# EAGLE design Stepper5 (EAGLE 7.6.0)
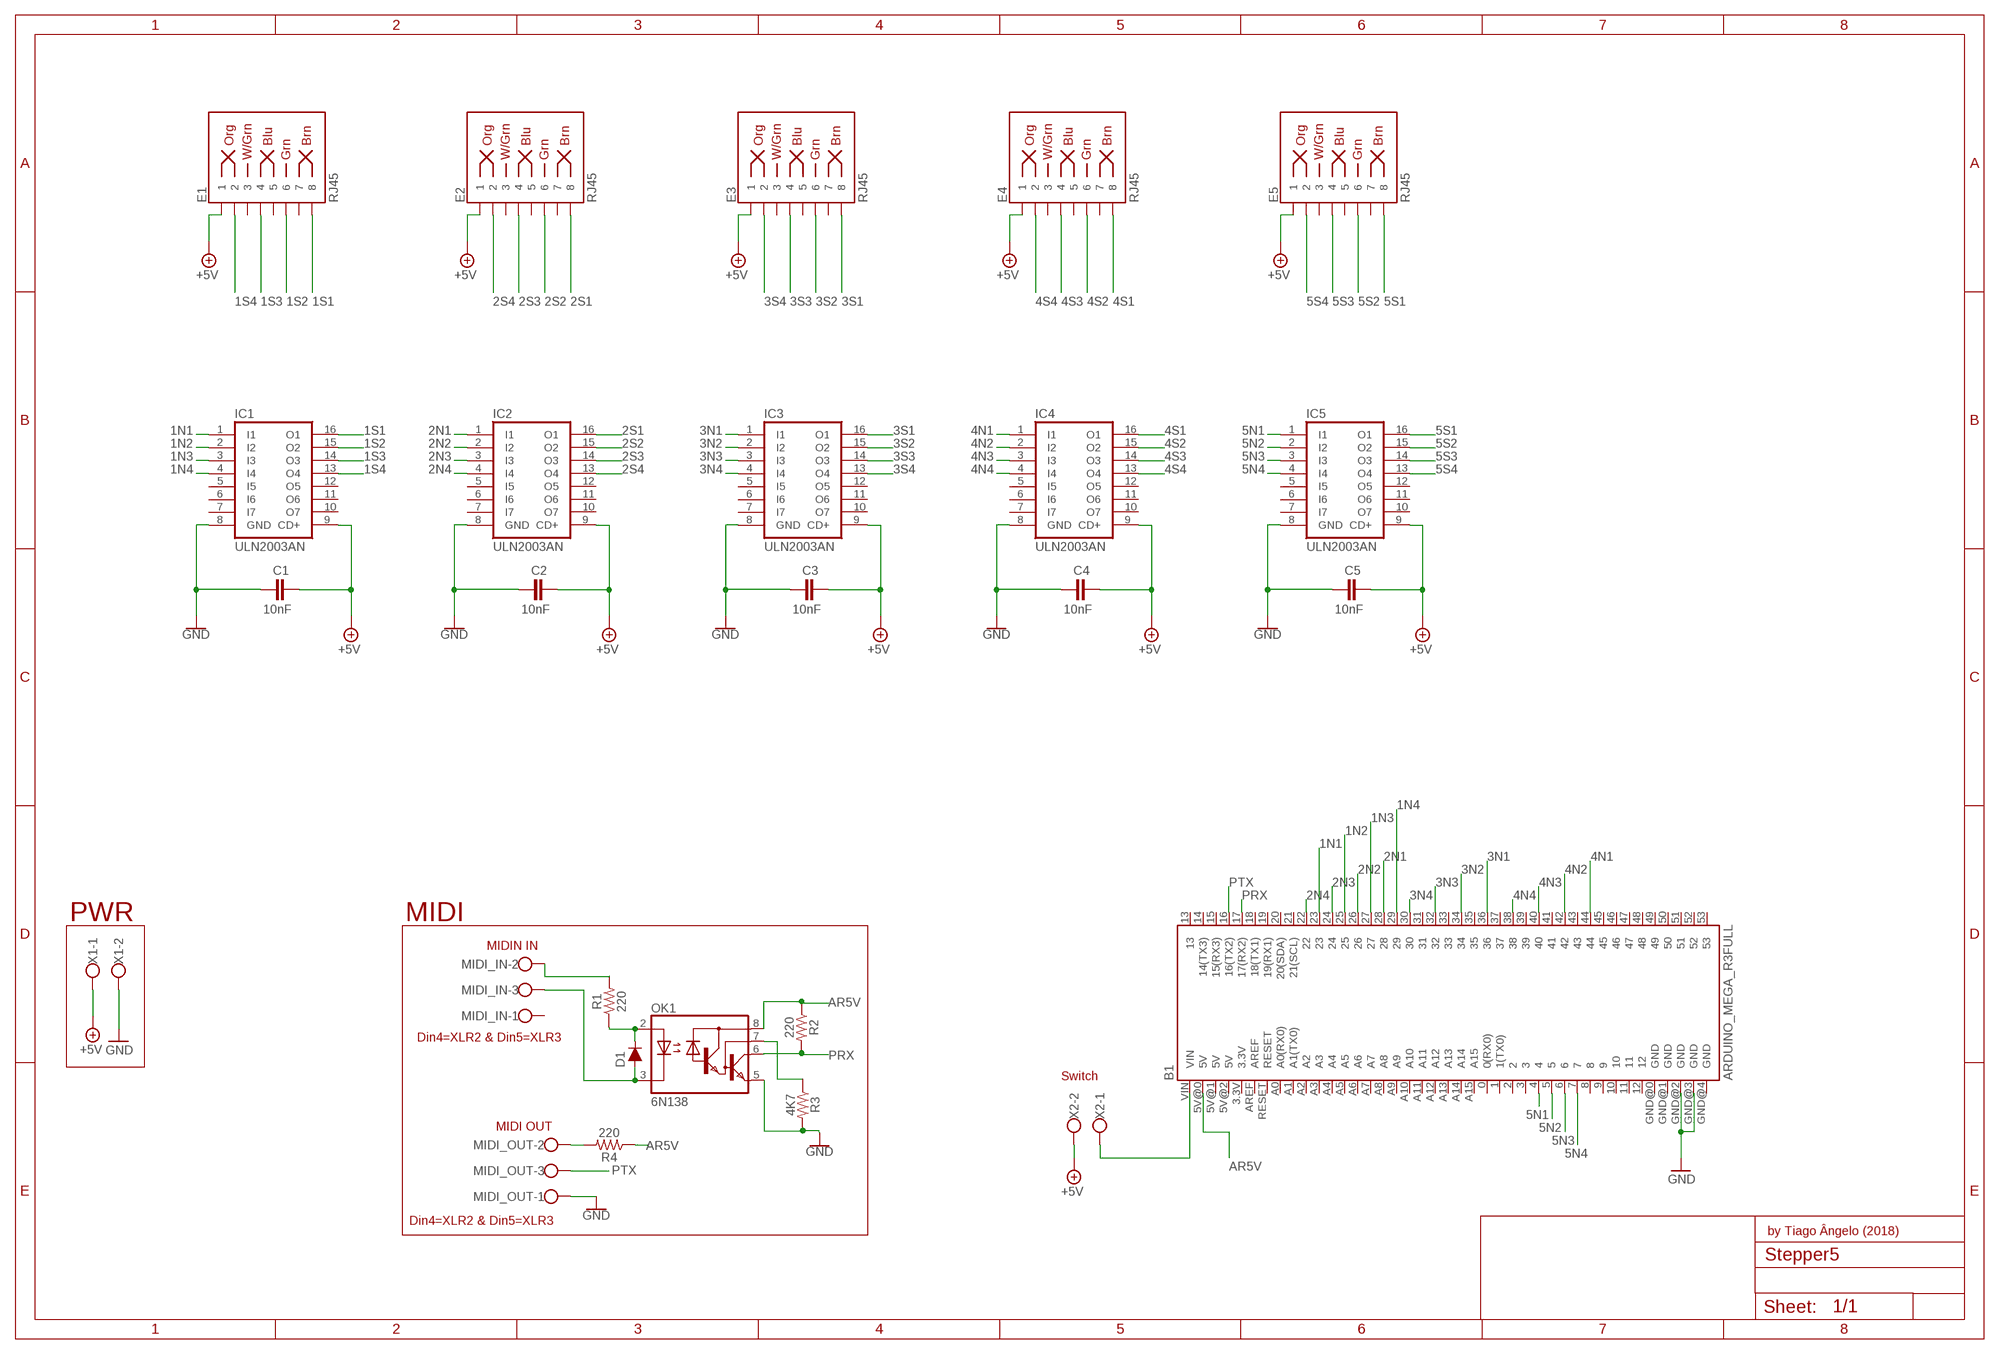
[diagram p0: schematic, sheet 1]

## Parts
B1  ARDUINO_MEGA_R3FULL  [ARDUINO_MEGA]
C1  10nF  C5/2.5  [C5B2.5]
C2  10nF  C5/2.5  [C5B2.5]
C3  10nF  C5/2.5  [C5B2.5]
C4  10nF  C5/2.5  [C5B2.5]
C5  10nF  C5/2.5  [C5B2.5]
D1  200mA/100V/1V  DIODE-1N4148  [DIODE-1N4148]
E1  RJ45  RJ45-8  [RJ45-8]
E2  RJ45  RJ45-8  [RJ45-8]
E3  RJ45  RJ45-8  [RJ45-8]
E4  RJ45  RJ45-8  [RJ45-8]
E5  RJ45  RJ45-8  [RJ45-8]
IC1  ULN2003AN  [DIL16]
IC2  ULN2003AN  [DIL16]
IC3  ULN2003AN  [DIL16]
IC4  ULN2003AN  [DIL16]
IC5  ULN2003AN  [DIL16]
MIDI_IN  W237-103  [W237-103]
MIDI_OUT  W237-103  [W237-103]
OK1  6N138  [DIL08]
R1  220  1KOHM-HORIZ-1/4W-5%  [AXIAL-0.3]
R2  220  1KOHM-HORIZ-1/4W-5%  [AXIAL-0.3]
R3  4K7  1KOHM-HORIZ-1/4W-5%  [AXIAL-0.3]
R4  220  1KOHM-HORIZ-1/4W-5%  [AXIAL-0.3]
X1  W237-102  [W237-102]
X2  W237-102  [W237-102]

## Nets
1N1: B1.23 IC1.1(I1)
1N2: B1.25 IC1.2(I2)
1N3: B1.27 IC1.3(I3)
1N4: B1.29 IC1.4(I4)
1S1: E1.8 IC1.16(O1)
1S2: E1.6 IC1.15(O2)
1S3: E1.4 IC1.14(O3)
1S4: E1.2 IC1.13(O4)
2N1: B1.28 IC2.1(I1)
2N2: B1.26 IC2.2(I2)
2N3: B1.24 IC2.3(I3)
2N4: B1.22 IC2.4(I4)
2S1: E2.8 IC2.16(O1)
2S2: E2.6 IC2.15(O2)
2S3: E2.4 IC2.14(O3)
2S4: E2.2 IC2.13(O4)
3N1: B1.36 IC3.1(I1)
3N2: B1.34 IC3.2(I2)
3N3: B1.32 IC3.3(I3)
3N4: B1.30 IC3.4(I4)
3S1: E3.8 IC3.16(O1)
3S2: E3.6 IC3.15(O2)
3S3: E3.4 IC3.14(O3)
3S4: E3.2 IC3.13(O4)
4N1: B1.44 IC4.1(I1)
4N2: B1.42 IC4.2(I2)
4N3: B1.40 IC4.3(I3)
4N4: B1.38 IC4.4(I4)
4S1: E4.8 IC4.16(O1)
4S2: E4.6 IC4.15(O2)
4S3: E4.4 IC4.14(O3)
4S4: E4.2 IC4.13(O4)
5N1: B1.4 IC5.1(I1)
5N2: B1.5 IC5.2(I2)
5N3: B1.6 IC5.3(I3)
5N4: B1.7 IC5.4(I4)
5S1: E5.8 IC5.16(O1)
5S2: E5.6 IC5.15(O2)
5S3: E5.4 IC5.14(O3)
5S4: E5.2 IC5.13(O4)
+5V: C1.2 C2.2 C3.2 C4.2 C5.2 E1.1 E2.1 E3.1 E4.1 E5.1 IC1.9(CD+) IC2.9(CD+) IC3.9(CD+) IC4.9(CD+) IC5.9(CD+) X1.1 X2.2
AR5V: B1.5V@0(5V) OK1.8(VCC) R2.P$1 R4.P$1
GND [GND]: B1.GND@2(GND) B1.GND@3(GND) C1.1 C2.1 C3.1 C4.1 C5.1 IC1.8(GND) IC2.8(GND) IC3.8(GND) IC4.8(GND) IC5.8(GND) MIDI_OUT.1 OK1.5(GND) R3.P$2 X1.2
N$1: B1.VIN X2.1
N$2: MIDI_OUT.2 R4.P$2
N$25: D1.A MIDI_IN.3 OK1.3(C)
N$26: D1.C OK1.2(A) R1.P$1
N$27: MIDI_IN.2 R1.P$2
N$29: OK1.7(VB) R3.P$1
PRX: B1.17(17(RX2)) OK1.6(VO) R2.P$2
PTX: B1.16(16(TX2)) MIDI_OUT.3
Unconnected: B1.0(0(RX0)) B1.1(1(TX0)) B1.2 B1.3 B1.3.3V B1.5V@1(5V) B1.5V@2(5V) B1.8 B1.9 B1.10 B1.11 B1.12 B1.13 B1.14(14(TX3)) B1.15(15(RX3)) B1.18(18(TX1)) B1.19(19(RX1)) B1.20(20(SDA)) B1.21(21(SCL)) B1.31 B1.33 B1.35 B1.37 B1.39 B1.41 B1.43 B1.45 B1.46 B1.47 B1.48 B1.49 B1.50 B1.51 B1.52 B1.53 B1.A0(A0(RX0)) B1.A1(A1(TX0)) B1.A2 B1.A3 B1.A4 B1.A5 B1.A6 B1.A7 B1.A8 B1.A9 B1.A10 B1.A11 B1.A12 B1.A13 B1.A14 B1.A15 B1.AREF B1.GND@0(GND) B1.GND@1(GND) B1.GND@4(GND) B1.RESET E1.3 E1.5 E1.7 E2.3 E2.5 E2.7 E3.3 E3.5 E3.7 E4.3 E4.5 E4.7 E5.3 E5.5 E5.7 IC1.5(I5) IC1.6(I6) IC1.7(I7) IC1.10(O7) IC1.11(O6) IC1.12(O5) IC2.5(I5) IC2.6(I6) IC2.7(I7) IC2.10(O7) IC2.11(O6) IC2.12(O5) IC3.5(I5) IC3.6(I6) IC3.7(I7) IC3.10(O7) IC3.11(O6) IC3.12(O5) IC4.5(I5) IC4.6(I6) IC4.7(I7) IC4.10(O7) IC4.11(O6) IC4.12(O5) IC5.5(I5) IC5.6(I6) IC5.7(I7) IC5.10(O7) IC5.11(O6) IC5.12(O5) MIDI_IN.1

## Notes on the sheet
- PWR | MIDI
- MIDIN IN
- Din4=XLR2 & Din5=XLR3
- Switch
- MIDI OUT
- Din4=XLR2 & Din5=XLR3
- by Tiago Ângelo (2018)

## Library data of the parts
B1 = SparkFun-Boards:ARDUINO_MEGA_R3: Arduino Mega R3 ATmega2560 R3 compatible footprint. SparkFun Products: Arduino Mega 2560 R3 <https://www.sparkfun.com/products/11061>
C1-C5 = capacitor-wima:C: CAPACITOR naming: grid - package width
D1 = SparkFun-DiscreteSemi:DIODE: Diode These are standard reverse protection diodes and small signal diodes. SparkFun Products: SparkFun SparkPunk Sound Kit <https://www.sparkfun.com/products/11177> SparkFun ESP8266 Thing <https://www.sparkfun.com/products/13231>; PROD_ID: DIO-08378
E1-E5 = SparkFun-Connectors:RJ45-8: RJ45 Jack - 8 pin Simple RJ45, 8-pin connection. Commonly used for Cat5, Cat5e, and Cat6 Ethernet cables. Here is the connector we sell at SparkFun: RJ45 8-Pin Connector <https://www.sparkfun.com/products/643> (PRT-00643) Datasheet <https://cdn.sparkfun.com/datasheets/Prototyping/04908.pdf> It is used on this SparkFun product: SparkFun RJ45 Breakout <https://www.sparkfun.com/products/716> (BOB-00716) Note, you may also be interested in the "MAGJACK" version of this. It is basically a RJ45 connector, but also has some status LEDs built into the connector housing. You can check that out in this library at the device named "MAGJACK.dev" and see these products online: RJ45 Ethernet MagJack-Compatible <https://www.sparkfun.com/products/8534> (PRT-08534) SparkFun RJ45 MagJack Breakout <https://www.sparkfun.com/products/13021> (BOB-13021); PROD_ID: CONN-08506; SF_ID: PRT-00643
IC1-IC5 = uln-udn:ULN2003A: DRIVER ARRAY
MIDI_IN MIDI_OUT = con-wago-500:W237-103: WAGO SCREW CLAMP; MPN: 237-103; OC_FARNELL: unknown; OC_NEWARK: 18M7116
OK1 = optocoupler:6N138: MOTOROLA OPTO COUPLER; MF: VISHAY/TELEFUNKEN; MPN: 6N138; OC_FARNELL: 9860150; OC_NEWARK: 35K5294
R1-R4 = SparkFun-Resistors:1KOHM: 1kΩ resistor A resistor is a passive two-terminal electrical component that implements electrical resistance as a circuit element. Resistors act to reduce current flow, and, at the same time, act to lower voltage levels within circuits. - Wikipedia; PROD_ID: RES-08380; VALUE: 1k
X1 X2 = con-wago-500:W237-102: WAGO SCREW CLAMP; MPN: 237-102; OC_FARNELL: unknown; OC_NEWARK: 70K9898

## Net classes
1 GND: width 1.016 mm, drill 0.508 mm, clearance 0.508 mm

## Board
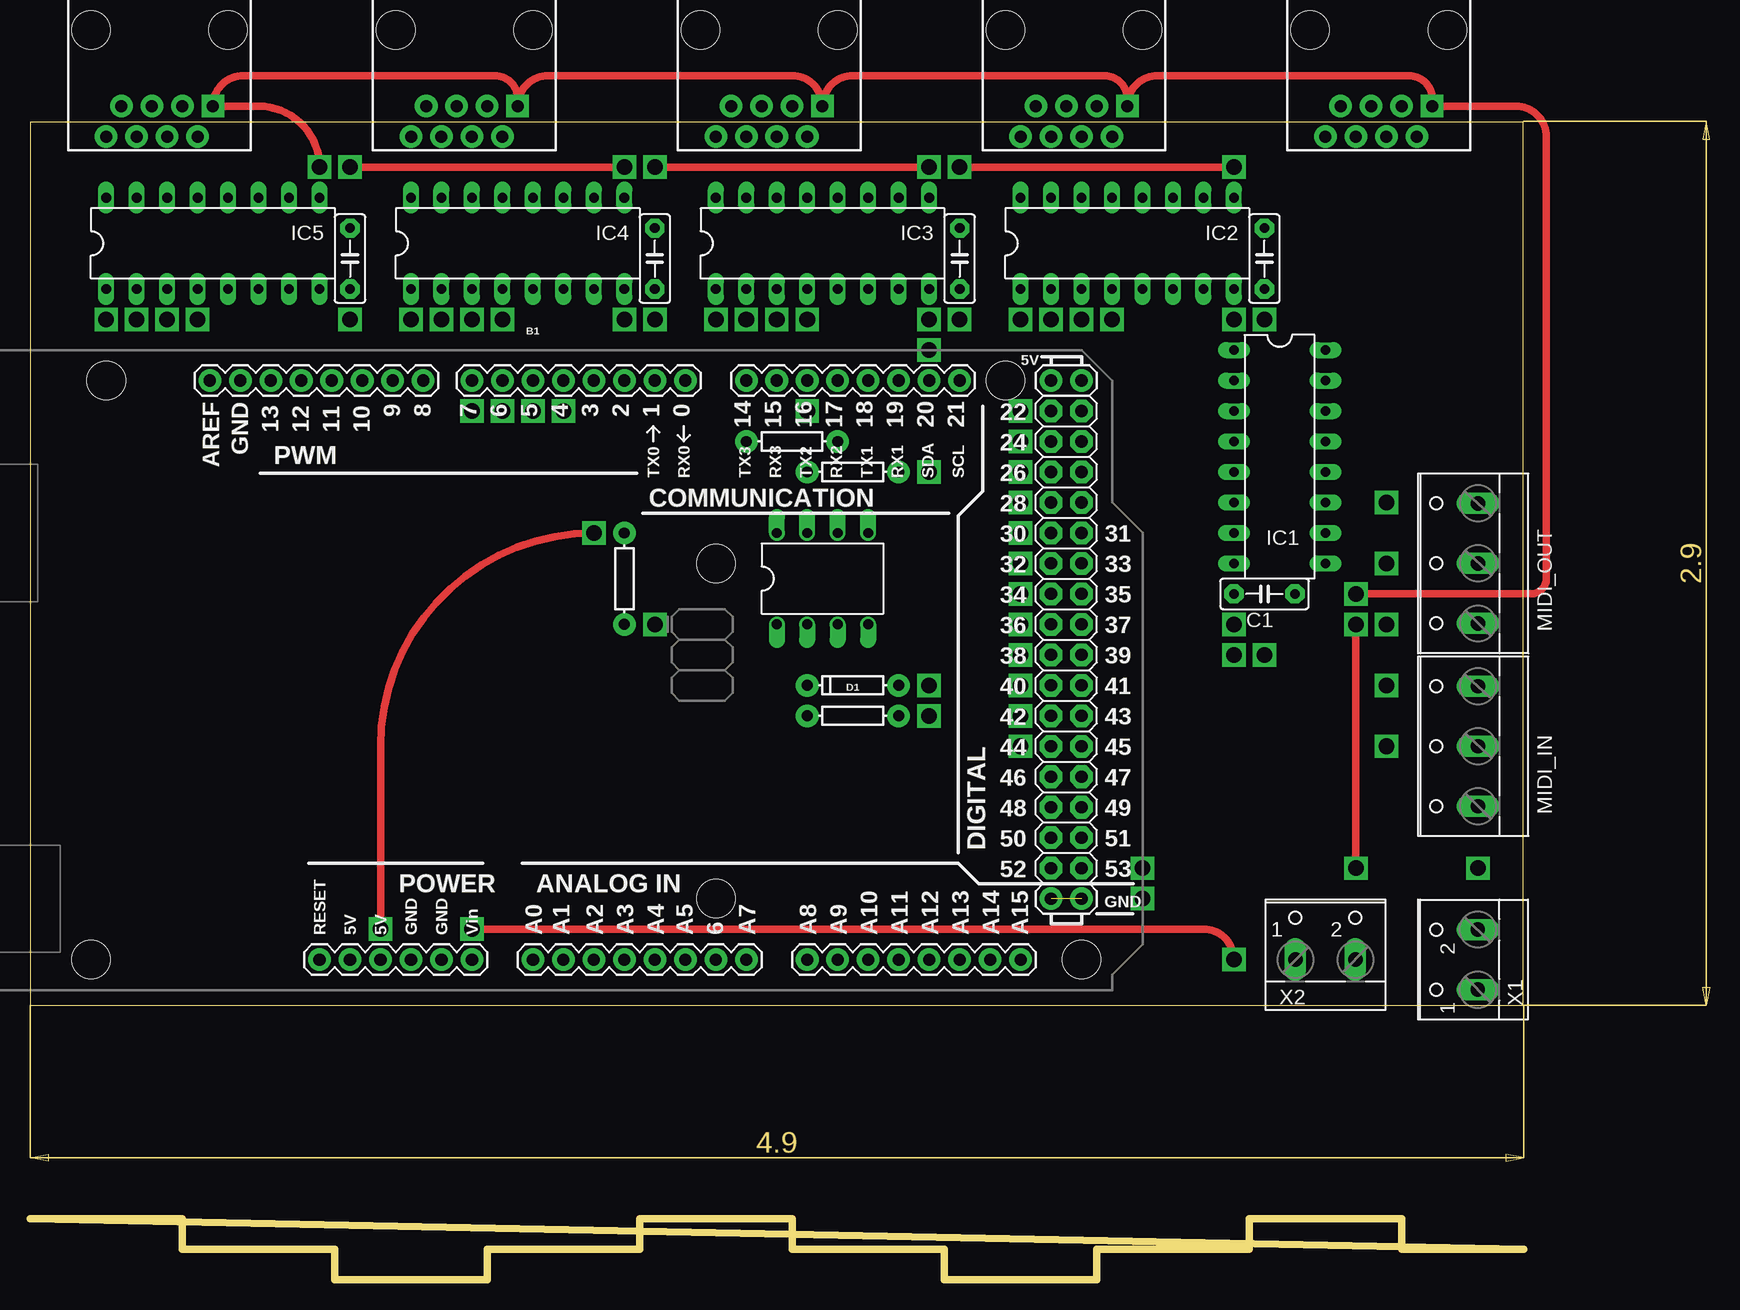
[diagram p1: board, top side]
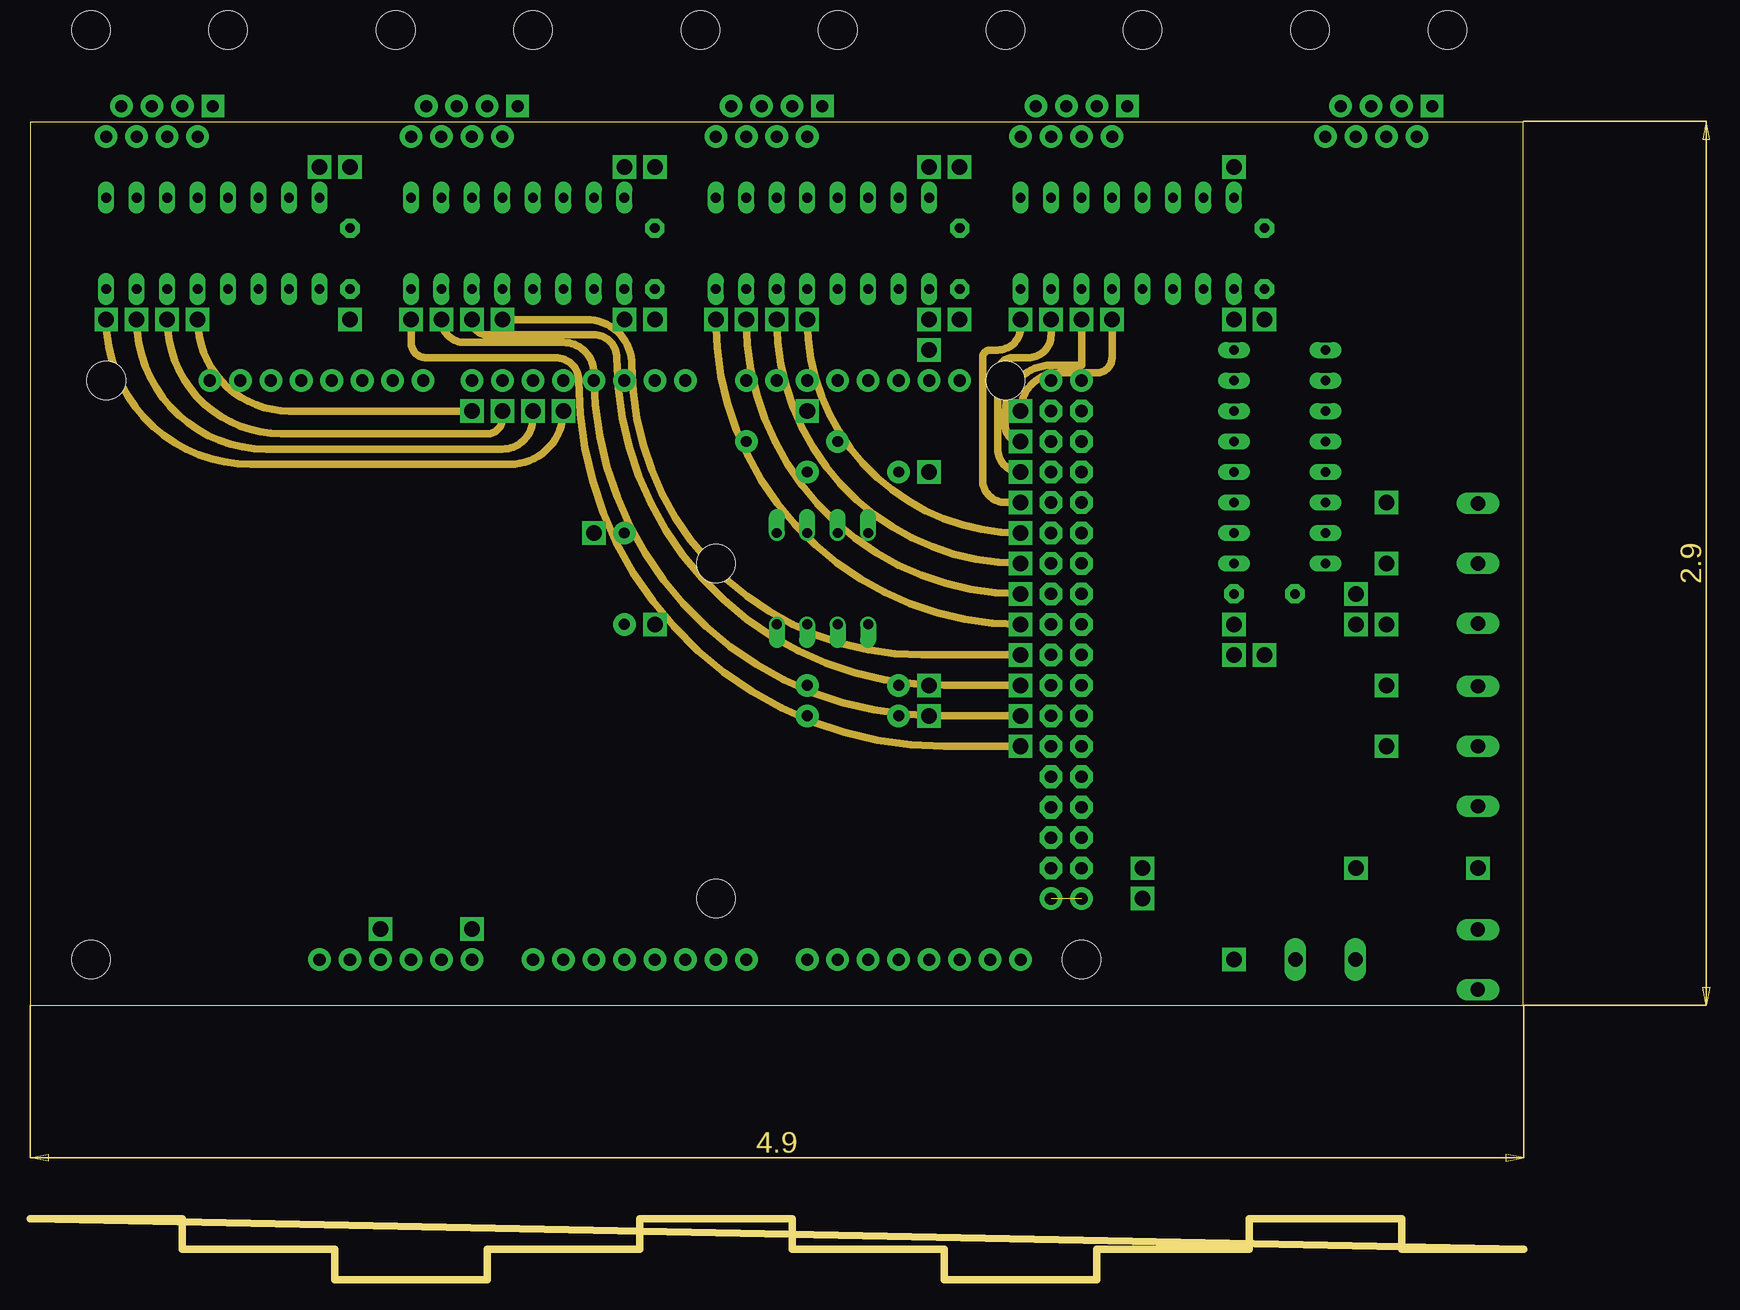
[diagram p2: board, inner layer FlyWire1]
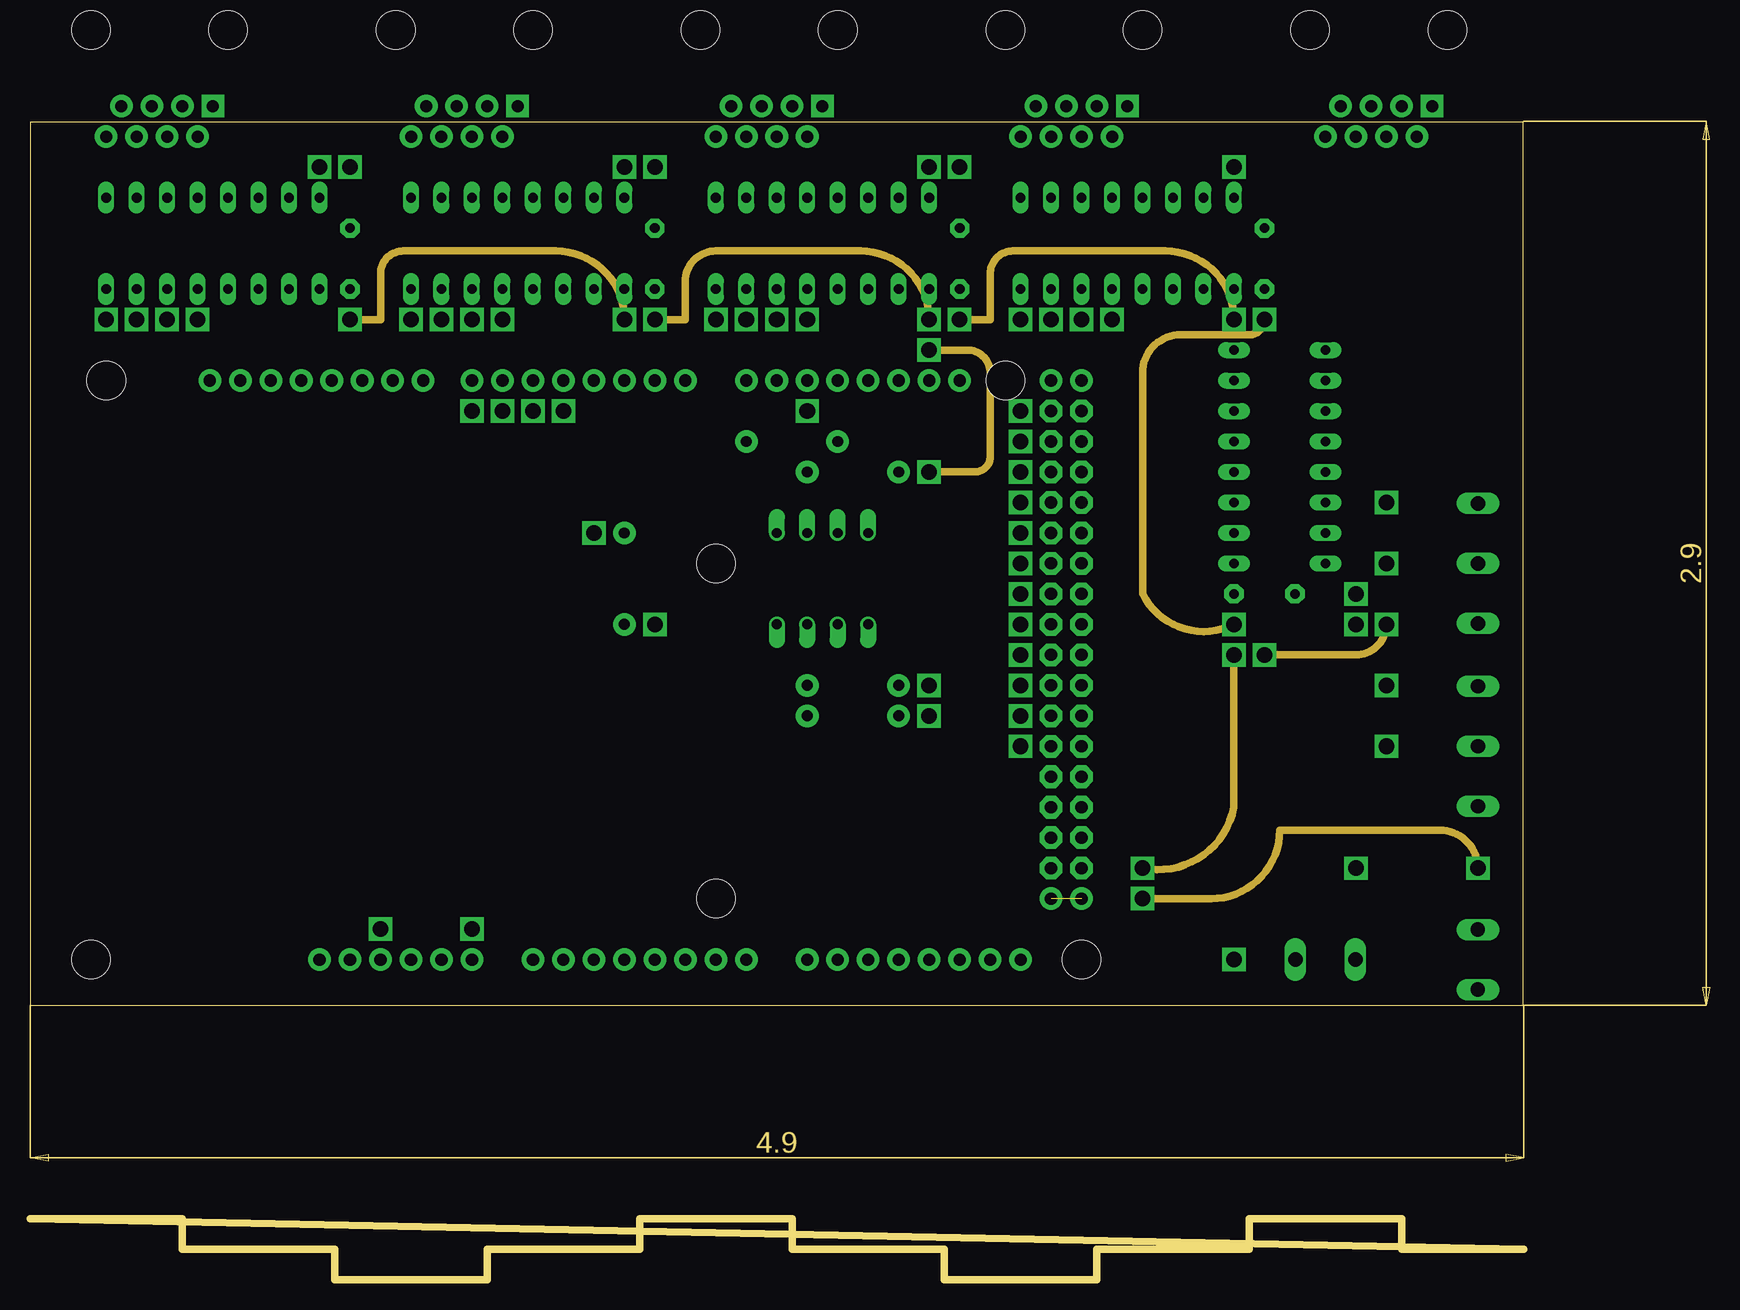
[diagram p3: board, inner layer WireGND]
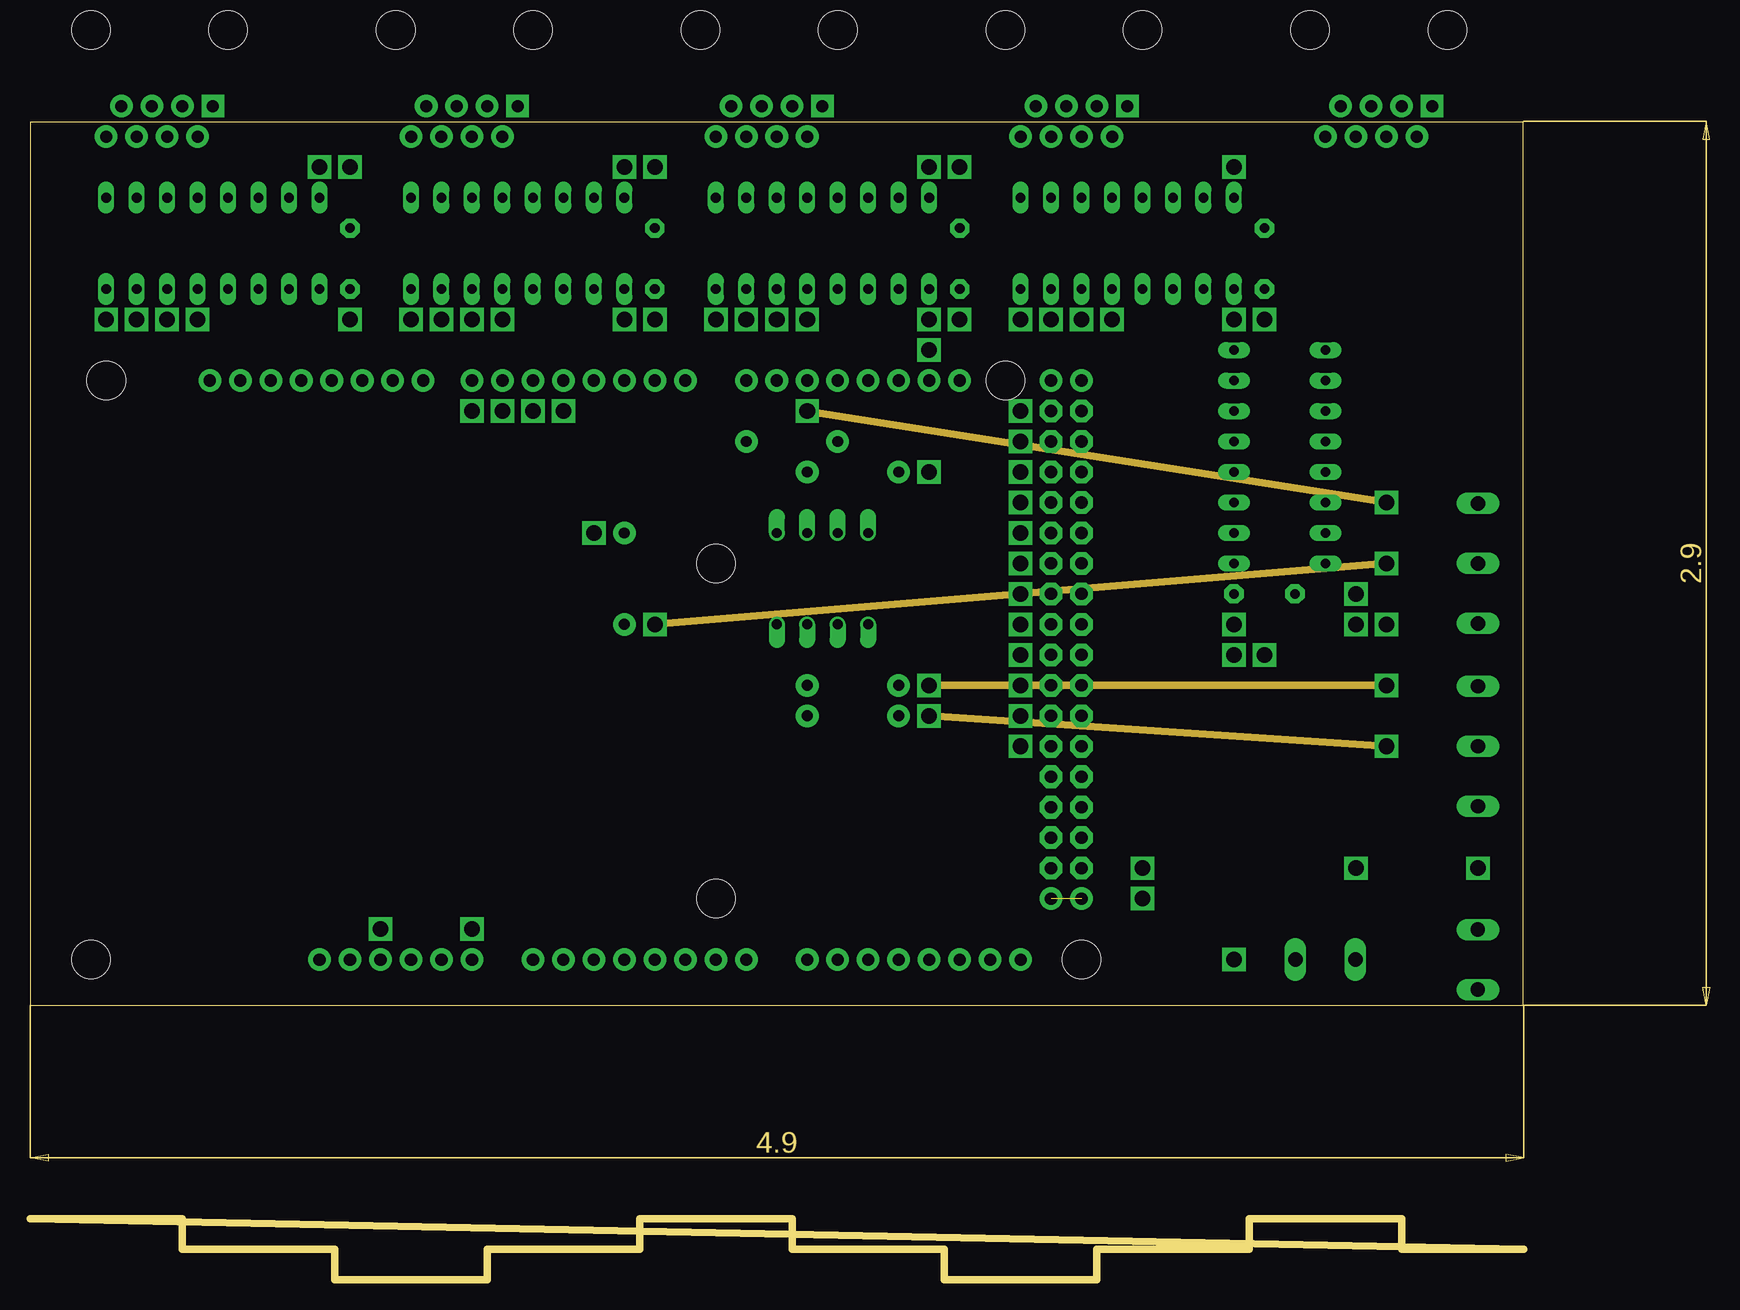
[diagram p4: board, inner layer FlyWire2]
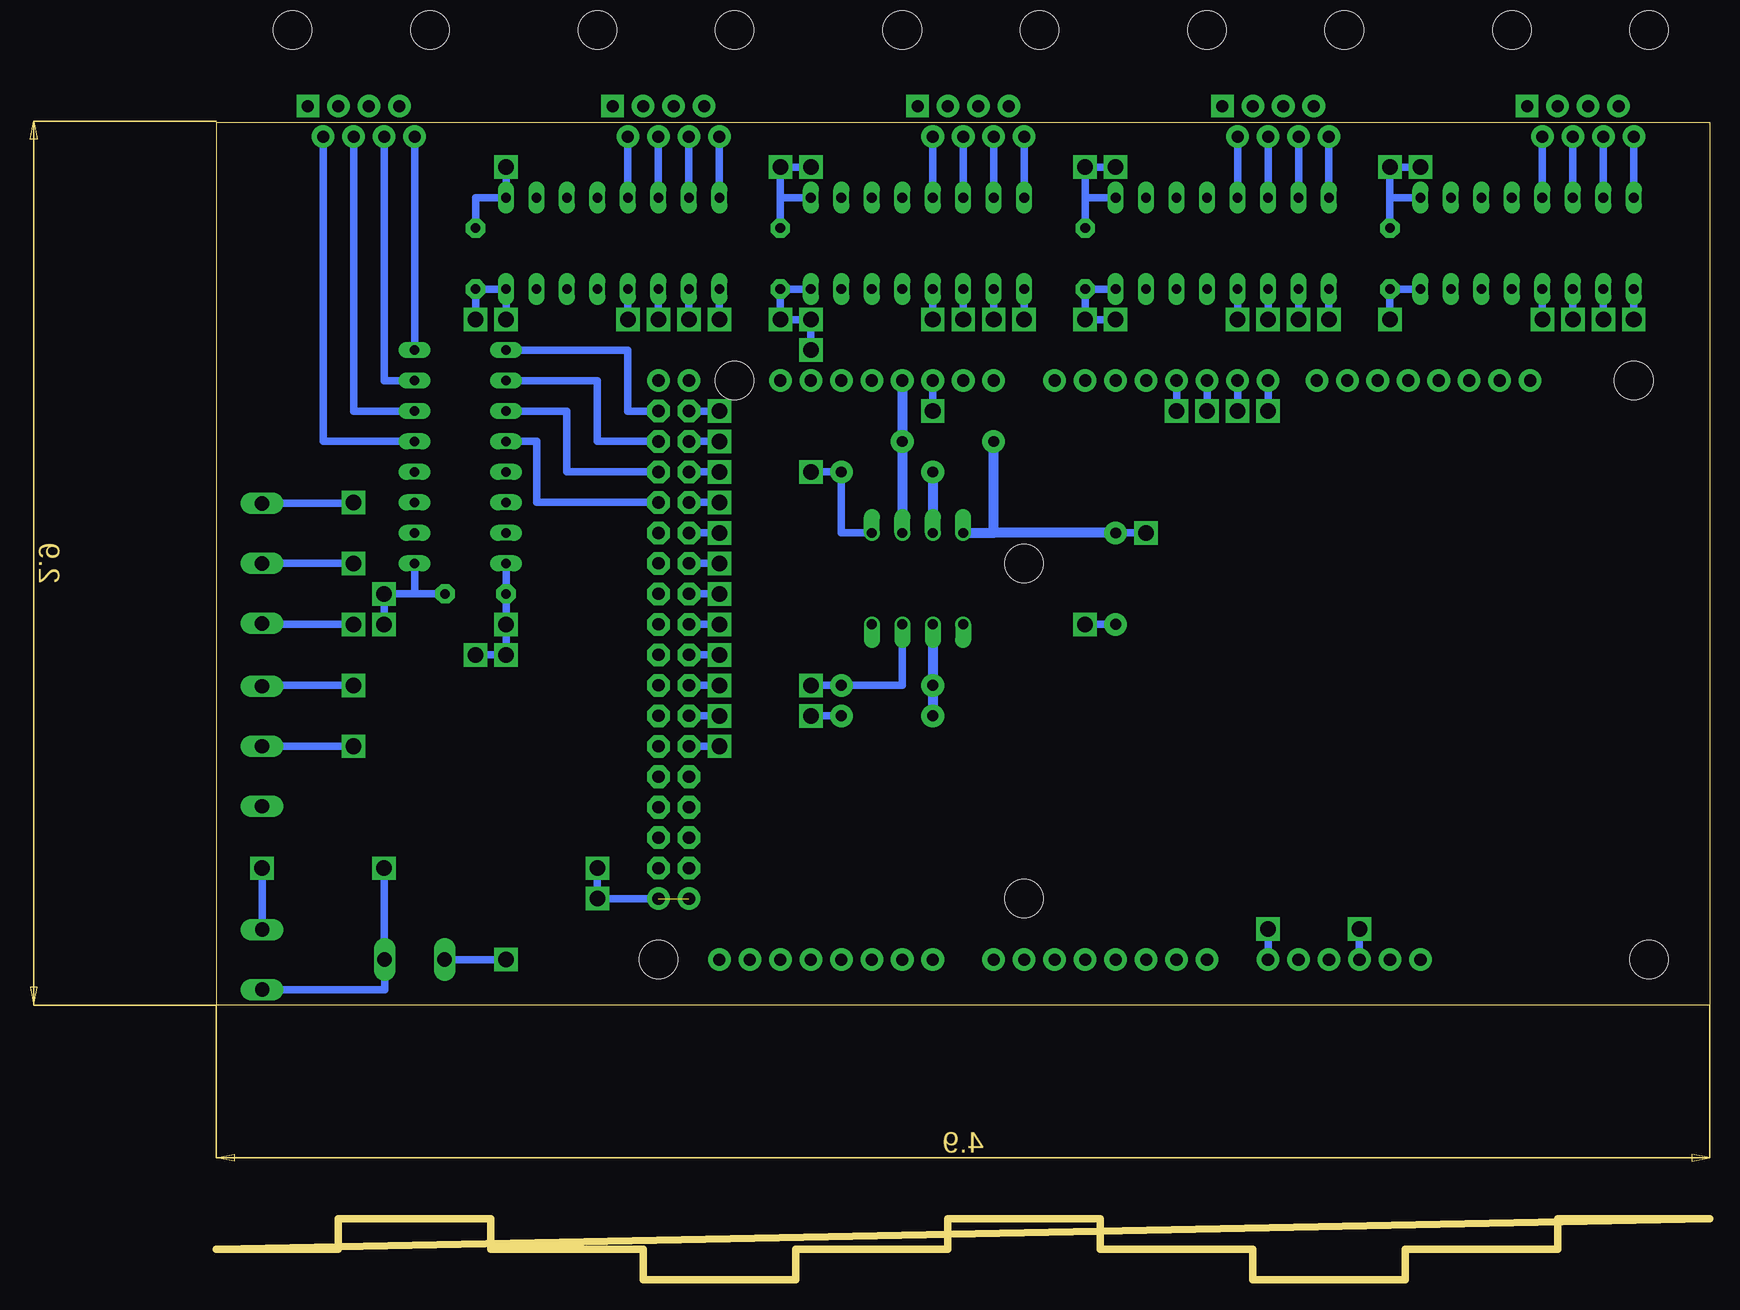
[diagram p5: board, bottom side, seen from below]

Size 140 x 96.52 mm. Coordinates in mm from the lower left corner, seen from the top.
Outline: 0,22.86 124.44,22.86 124.44,96.44 0,96.44 0,22.86
Copper layers (1*2*3*4*16): Wire5V 0.035mm / dielectric 1.5mm / FlyWire1 0.035mm / dielectric 0.15mm / WireGND 0.035mm / dielectric 0.2mm / FlyWire2 0.035mm / dielectric 0.15mm / Bottom 0.035mm
Design rules "default *": minimum track width 10mil, minimum drill 24mil, track to track 8mil, track to pad 8mil, pad to pad 8mil, via to via 8mil, smd to smd 8mil, copper to edge 40mil, drill to drill 8mil, minimum pad ring 10mil, minimum via ring 8mil, stop-mask expansion 4mil, vias tented up to drill 0mil, thermal gap 10mil

### Footprints (pad centres in the part's own frame; a part is rotated, then mirrored left to right if it is on the bottom)
ARDUINO_MEGA = drill 1.016 pad 1.88: 0 13.97,24.13; 1 11.43,24.13; 2 8.89,24.13; 3 6.35,24.13; 3.3V -13.97,-24.13; 4 3.81,24.13; 5 1.27,24.13; 5V@0 -11.43,-24.13; 5V@1 44.45,24.13; 5V@2 46.99,24.13; 6 -1.27,24.13; 7 -3.81,24.13; 8 -7.874,24.13; 9 -10.414,24.13; 10 -12.954,24.13; 11 -15.494,24.13; 12 -18.034,24.13; 13 -20.574,24.13; 14 19.05,24.13; 15 21.59,24.13; 16 24.13,24.13; 17 26.67,24.13; 18 29.21,24.13; 19 31.75,24.13; 20 34.29,24.13; 21 36.83,24.13; A0 1.27,-24.13; A1 3.81,-24.13; A2 6.35,-24.13; A3 8.89,-24.13; A4 11.43,-24.13; A5 13.97,-24.13; A6 16.51,-24.13; A7 19.05,-24.13; A8 24.13,-24.13; A9 26.67,-24.13; A10 29.21,-24.13; A11 31.75,-24.13; A12 34.29,-24.13; A13 36.83,-24.13; A14 39.37,-24.13; A15 41.91,-24.13; AREF -25.654,24.13; GND@0 -8.89,-24.13; GND@1 -6.35,-24.13; GND@2 44.45,-19.05; GND@3 46.99,-19.05; GND@4 -23.114,24.13; RESET -16.51,-24.13; VIN -3.81,-24.13 | drill 1.016 pad 1.88 octagon: 22 44.45,21.59; 23 46.99,21.59; 24 44.45,19.05; 25 46.99,19.05; 26 44.45,16.51; 27 46.99,16.51; 28 44.45,13.97; 29 46.99,13.97; 30 44.45,11.43; 31 46.99,11.43; 32 44.45,8.89; 33 46.99,8.89; 34 44.45,6.35; 35 46.99,6.35; 36 44.45,3.81; 37 46.99,3.81; 38 44.45,1.27; 39 46.99,1.27; 40 44.45,-1.27; 41 46.99,-1.27; 42 44.45,-3.81; 43 46.99,-3.81; 44 44.45,-6.35; 45 46.99,-6.35; 46 44.45,-8.89; 47 46.99,-8.89; 48 44.45,-11.43; 49 46.99,-11.43; 50 44.45,-13.97; 51 46.99,-13.97; 52 44.45,-16.51; 53 46.99,-16.51 | hole 3.2: -34.29,24.13; -35.56,-24.13; 16.51,8.89; 16.51,-19.05; 40.64,24.13; 46.99,-24.13
C5B2.5 = drill 0.813 pad 1.6 octagon: 1 -2.54,0; 2 2.54,0
DIODE-1N4148 = drill 0.9 pad 1.88: A -3.81,0; C 3.81,0
RJ45-8 = drill 1 pad 1.88 square: 1 -4.445,6.35 | drill 1 pad 1.88: 2 -3.175,8.89; 3 -1.905,6.35; 4 -0.635,8.89; 5 0.635,6.35; 6 1.905,8.89; 7 3.175,6.35; 8 4.445,8.89 | hole 3.2: -5.715,0; 5.715,0
DIL16 = drill 0.813 long: 1 -8.89,-3.81; 2 -6.35,-3.81; 3 -3.81,-3.81; 4 -1.27,-3.81; 5 1.27,-3.81; 6 3.81,-3.81; 7 6.35,-3.81; 8 8.89,-3.81; 9 8.89,3.81; 10 6.35,3.81; 11 3.81,3.81; 12 1.27,3.81; 13 -1.27,3.81; 14 -3.81,3.81; 15 -6.35,3.81; 16 -8.89,3.81
W237-103 = drill 1.194 long: 1 -5,-1.29; 2 0,-1.29; 3 5,-1.29
DIL08 = drill 0.813 offset: 1 -3.81,-3.81; 2 -1.27,-3.81; 3 1.27,-3.81; 4 3.81,-3.81; 5 3.81,3.81; 6 1.27,3.81; 7 -1.27,3.81; 8 -3.81,3.81
AXIAL-0.3 = drill 0.9 pad 1.88: P$1 -3.81,0; P$2 3.81,0
W237-102 = drill 1.194 long: 1 -2.5,-1.27; 2 2.5,-1.27

### Placement (x,y rotation side)
B1  40.64,50.8 0 top
C1  102.87,57.15 0 top
C2  102.87,85.09 90 top
C3  77.47,85.09 90 top
C4  52.07,85.09 90 top
C5  26.67,85.09 90 top
D1  68.58,49.53 180 top
E1  112.39,104.14 180 top
E2  87,104.14 180 top
E3  61.59,104.14 180 top
E4  36.2,104.14 180 top
E5  10.79,104.14 180 top
IC1  104.14,68.58 270 top
IC2  91.44,86.36 0 top
IC3  66.04,86.36 0 top
IC4  40.64,86.36 0 top
IC5  15.24,86.36 0 top
MIDI_IN  119.38,44.45 90 top
MIDI_OUT  119.38,59.69 90 top
OK1  66.04,58.42 0 top
R1  68.58,46.99 0 top
R2  63.5,69.85 0 top
R3  68.58,67.31 0 top
R4  49.53,58.42 270 top
X1  119.38,26.67 90 top
X2  107.95,27.94 0 top

### Tracks (layer width: path | path; a pad name or v marks a point on that pad's centre or on a via)
1N1
  Bottom 0.61: B1.23 90.17,72.39 90.17,77.47 IC1.1
1N2
  Bottom 0.61: B1.25 92.71,69.85 92.71,74.93 IC1.2
1N3
  Bottom 0.61: B1.27 95.25,67.31 95.25,72.39 IC1.3
1N4
  Bottom 0.61: B1.29 97.79,64.77 97.79,69.85 IC1.4
1S1
  Bottom 0.61: IC1.16 E1.8
1S2
  Bottom 0.61: E1.6 110.49,74.93 IC1.15
1S3
  Bottom 0.61: E1.4 113.03,72.39 IC1.14
1S4
  Bottom 0.61: E1.2 115.57,69.85 IC1.13
2N1  (via drill 1.3)
  FlyWire1 0.61: v82.55,80.01 82.55,79.38 arc-90 80.64,77.47 80.01,77.47 arc90 79.38,76.84 79.38,66.67 arc90 81.28,64.77 v82.55,64.77
  Bottom 0.61: B1.28 v82.55,64.77 | IC2.1 v82.55,80.01
2N2  (via drill 1.3)
  FlyWire1 0.61: v85.09,80.01 85.09,78.74 arc-90 83.19,76.84 81.92,76.84 arc90 80.64,75.56 80.64,69.22 arc90 v82.55,67.31
  Bottom 0.61: B1.26 v82.55,67.31 | IC2.2 v85.09,80.01
2N3  (via drill 1.3)
  FlyWire1 0.61: v87.63,80.01 87.63,76.2 85.09,76.2 arc90 81.28,72.39 81.28,71.12 arc90 v82.55,69.85
  Bottom 0.61: B1.24 v82.55,69.85 | v87.63,80.01 IC2.3
2N4  (via drill 1.3)
  FlyWire1 0.61: v90.17,80.01 90.17,76.84 arc-90 88.9,75.56 85.72,75.56 arc90 v82.55,72.39
  Bottom 0.61: B1.22 v82.55,72.39 | v90.17,80.01 IC2.4
2S1
  Bottom 0.61: E2.8 IC2.16
2S2
  Bottom 0.61: E2.6 IC2.15
2S3
  Bottom 0.61: E2.4 IC2.14
2S4
  Bottom 0.61: E2.2 IC2.13
3N1  (via drill 1.3)
  FlyWire1 0.61: v57.15,80.01 arc90 v82.55,54.61
  Bottom 0.61: v82.55,54.61 B1.36 | IC3.1 v57.15,80.01
3N2  (via drill 1.3)
  FlyWire1 0.61: v59.69,80.01 arc90 v82.55,57.15
  Bottom 0.61: B1.34 v82.55,57.15 | IC3.2 v59.69,80.01
3N3  (via drill 1.3)
  FlyWire1 0.61: v62.23,80.01 arc90 v82.55,59.69
  Bottom 0.61: v82.55,59.69 B1.32 | IC3.3 v62.23,80.01
3N4  (via drill 1.3)
  FlyWire1 0.61: v64.77,80.01 arc90 v82.55,62.23
  Bottom 0.61: B1.30 v82.55,62.23 | IC3.4 v64.77,80.01
3S1
  Bottom 0.61: IC3.16 E3.8
3S2
  Bottom 0.61: IC3.15 E3.6
3S3
  Bottom 0.61: IC3.14 E3.4
3S4
  Bottom 0.61: IC3.13 E3.2
4N1  (via drill 1.3)
  FlyWire1 0.61: v31.75,80.01 31.75,78.1 arc90 33.02,76.84 43.81,76.84 arc-90 45.72,74.93 arc90 76.2,44.45 v82.55,44.45
  Bottom 0.61: B1.44 v82.55,44.45 | IC4.1 v31.75,80.01
4N2  (via drill 1.3)
  FlyWire1 0.61: v34.29,80.01 arc90 36.2,78.1 44.45,78.1 arc-90 46.99,75.56 arc90 75.56,46.99 v82.55,46.99
  Bottom 0.61: B1.42 v82.55,46.99 | IC4.2 v34.29,80.01
4N3  (via drill 1.3)
  FlyWire1 0.61: v36.83,80.01 arc90 38.1,78.74 46.99,78.74 arc-90 48.9,76.84 arc90 76.2,49.53 v82.55,49.53
  Bottom 0.61: v82.55,49.53 B1.40 | IC4.3 v36.83,80.01
4N4  (via drill 1.3)
  FlyWire1 0.61: v39.37,80.01 46.35,80.01 arc-90 50.16,76.2 arc90 74.3,52.07 v82.55,52.07
  Bottom 0.61: v82.55,52.07 B1.38 | IC4.4 v39.37,80.01
4S1
  Bottom 0.61: E4.8 IC4.16
4S2
  Bottom 0.61: E4.6 IC4.15
4S3
  Bottom 0.61: IC4.14 E4.4
4S4
  Bottom 0.61: IC4.13 E4.2
5N1  (via drill 1.3)
  FlyWire1 0.61: v44.45,72.39 arc-90 40.01,67.94 18.41,67.94 arc-90 v6.35,80.01
  Bottom 0.61: IC5.1 v6.35,80.01 | v44.45,72.39 B1.4
5N2  (via drill 1.3)
  FlyWire1 0.61: v41.91,72.39 41.91,71.75 arc-90 39.37,69.22 19.68,69.22 arc-90 v8.89,80.01
  Bottom 0.61: IC5.2 v8.89,80.01 | v41.91,72.39 B1.5
5N3  (via drill 1.3)
  FlyWire1 0.61: v39.37,72.39 39.37,71.75 arc-90 38.1,70.48 20.95,70.48 arc-90 v11.43,80.01
  Bottom 0.61: IC5.3 v11.43,80.01 | v39.37,72.39 B1.6
5N4  (via drill 1.3)
  FlyWire1 0.61: v36.83,72.39 21.59,72.39 arc-90 v13.97,80.01
  Bottom 0.61: IC5.4 v13.97,80.01 | B1.7 v36.83,72.39
5S1
  Bottom 0.61: IC5.16 E5.8
5S2
  Bottom 0.61: IC5.15 E5.6
5S3
  Bottom 0.61: IC5.14 E5.4
5S4
  Bottom 0.61: IC5.13 E5.2
+5V  (via drill 1.3)
  Wire5V 0.61: v110.49,57.15 125.09,57.15 arc90 126.36,58.42 126.36,95.25 arc90 123.83,97.79 E1.1 116.84,98.42 arc90 114.94,100.33 93.98,100.33 arc90 E2.1 91.44,98.42 arc90 89.53,100.33 68.58,100.33 arc90 E3.1 arc90 63.5,100.33 43.18,100.33 arc90 E4.1 40.64,98.42 arc90 38.73,100.33 17.78,100.33 arc90 E5.1 19.05,97.79 arc-90 v24.13,92.71 | v26.67,92.71 v49.53,92.71 | v52.07,92.71 v74.93,92.71 | v77.47,92.71 v100.33,92.71 | v110.49,34.29 v110.49,54.61
  Bottom 0.61: C5.2 26.67,90.17 | 26.67,90.17 IC5.9 | C4.2 52.07,90.17 | 52.07,90.17 IC4.9 | C3.2 77.47,90.17 | 77.47,90.17 IC3.9 | C2.2 102.87,90.17 IC2.9 v100.33,92.71 | C1.2 107.95,57.15 | 107.95,57.15 v110.49,57.15 v110.49,54.61 | 107.95,57.15 IC1.9 | 26.67,90.17 v26.67,92.71 v24.13,92.71 | v49.53,92.71 v52.07,92.71 52.07,90.17 | v74.93,92.71 v77.47,92.71 77.47,90.17 | v110.49,34.29 110.49,26.75 arc-90 110.45,26.71 X2.2 110.45,24.17 X1.1
AR5V  (via drill 1.3)
  Wire5V 0.61: v29.21,29.21 29.21,44.45 arc-90 v46.99,62.23
  Bottom 0.61: B1.5V@0 v29.21,29.21 | R4.P$1 v46.99,62.23
  Bottom 0.813: OK1.8 59.69,62.23 | 59.69,62.23 R2.P$1 | R4.P$1 59.69,62.23
GND  (via drill 1.3)  (1 unrouted)
  WireGND 0.61: v100.33,54.61 arc-90 92.71,57.15 92.71,75.56 arc-90 95.89,78.74 101.6,78.74 arc90 v102.87,80.01 | v92.71,34.29 arc90 100.33,39.37 v100.33,52.07 | v102.87,52.07 110.49,52.07 arc90 v113.03,54.61 | v74.93,67.31 78.74,67.31 arc90 80.01,68.58 80.01,75.56 arc90 78.11,77.47 v74.93,77.47 | v26.67,80.01 29.21,80.01 29.21,83.82 arc-90 31.11,85.72 43.81,85.72 arc-90 v49.53,80.01 | v52.07,80.01 54.61,80.01 54.61,83.19 arc-90 57.15,85.72 69.22,85.72 arc-90 v74.93,80.01 | v77.47,80.01 80.01,80.01 80.01,83.82 arc-90 81.92,85.72 94.61,85.72 arc-90 v100.33,80.01 | v120.65,34.29 arc90 117.47,37.47 104.14,37.47 arc-90 98.42,31.75 v92.71,31.75
  Bottom 0.61: OK1.5 72.39,62.23 R3.P$2 v74.93,67.31 | IC5.8 C5.1 v26.67,80.01 | IC4.8 C4.1 v52.07,80.01 v49.53,80.01 | IC3.8 C3.1 v77.47,80.01 v74.93,80.01 v74.93,77.47 | IC1.8 C1.1 v100.33,54.61 v100.33,52.07 v102.87,52.07 | v113.03,54.61 120.59,54.61 MIDI_OUT.1 | v102.87,80.01 C2.1 IC2.8 v100.33,80.01 | B1.GND@3 v92.71,31.75 v92.71,34.29 | X1.2 v120.65,34.29
N$1  (via drill 1.3)
  Wire5V 0.61: v100.33,26.67 arc90 97.79,29.21 v36.83,29.21
  Bottom 0.61: B1.VIN v36.83,29.21 | X2.1 v100.33,26.67
N$2  (via drill 1.3)
  FlyWire2 0.61: v113.03,59.69 v52.07,54.61
  Bottom 0.61: MIDI_OUT.2 v113.03,59.69 | R4.P$2 v52.07,54.61
N$25  (via drill 1.3)
  FlyWire2 0.61: v113.03,49.53 v74.93,49.53
  Bottom 0.61: OK1.3 67.31,49.53 D1.A v74.93,49.53 | v113.03,49.53 120.59,49.53 MIDI_IN.3
N$26
  Bottom 0.813: OK1.2 D1.C R1.P$1
N$27  (via drill 1.3)
  FlyWire2 0.61: v113.03,44.45 v74.93,46.99
  Bottom 0.61: v113.03,44.45 MIDI_IN.2 | v74.93,46.99 R1.P$2
N$29
  Bottom 0.813: R3.P$1 OK1.7
PRX
  Bottom 0.813: B1.17 R2.P$2 OK1.6
PTX  (via drill 1.3)
  FlyWire2 0.61: v113.03,64.77 v64.77,72.39
  Bottom 0.61: MIDI_OUT.3 113.03,64.69 v113.03,64.77 | B1.16 v64.77,72.39